# EasyEDA Pro project ProPrj_51单片机核心板_2025-02-26.epro

# Schematic 原理图
Board Name: 核心板; Create Date: 2025-02-26; Page Name: P1; Project Name: 51单片机核心板; Schematic Name: 原理图; Update Date: 2025-02-26; Company: 嘉立创EDA; Page Size: A4; Version: V1.0
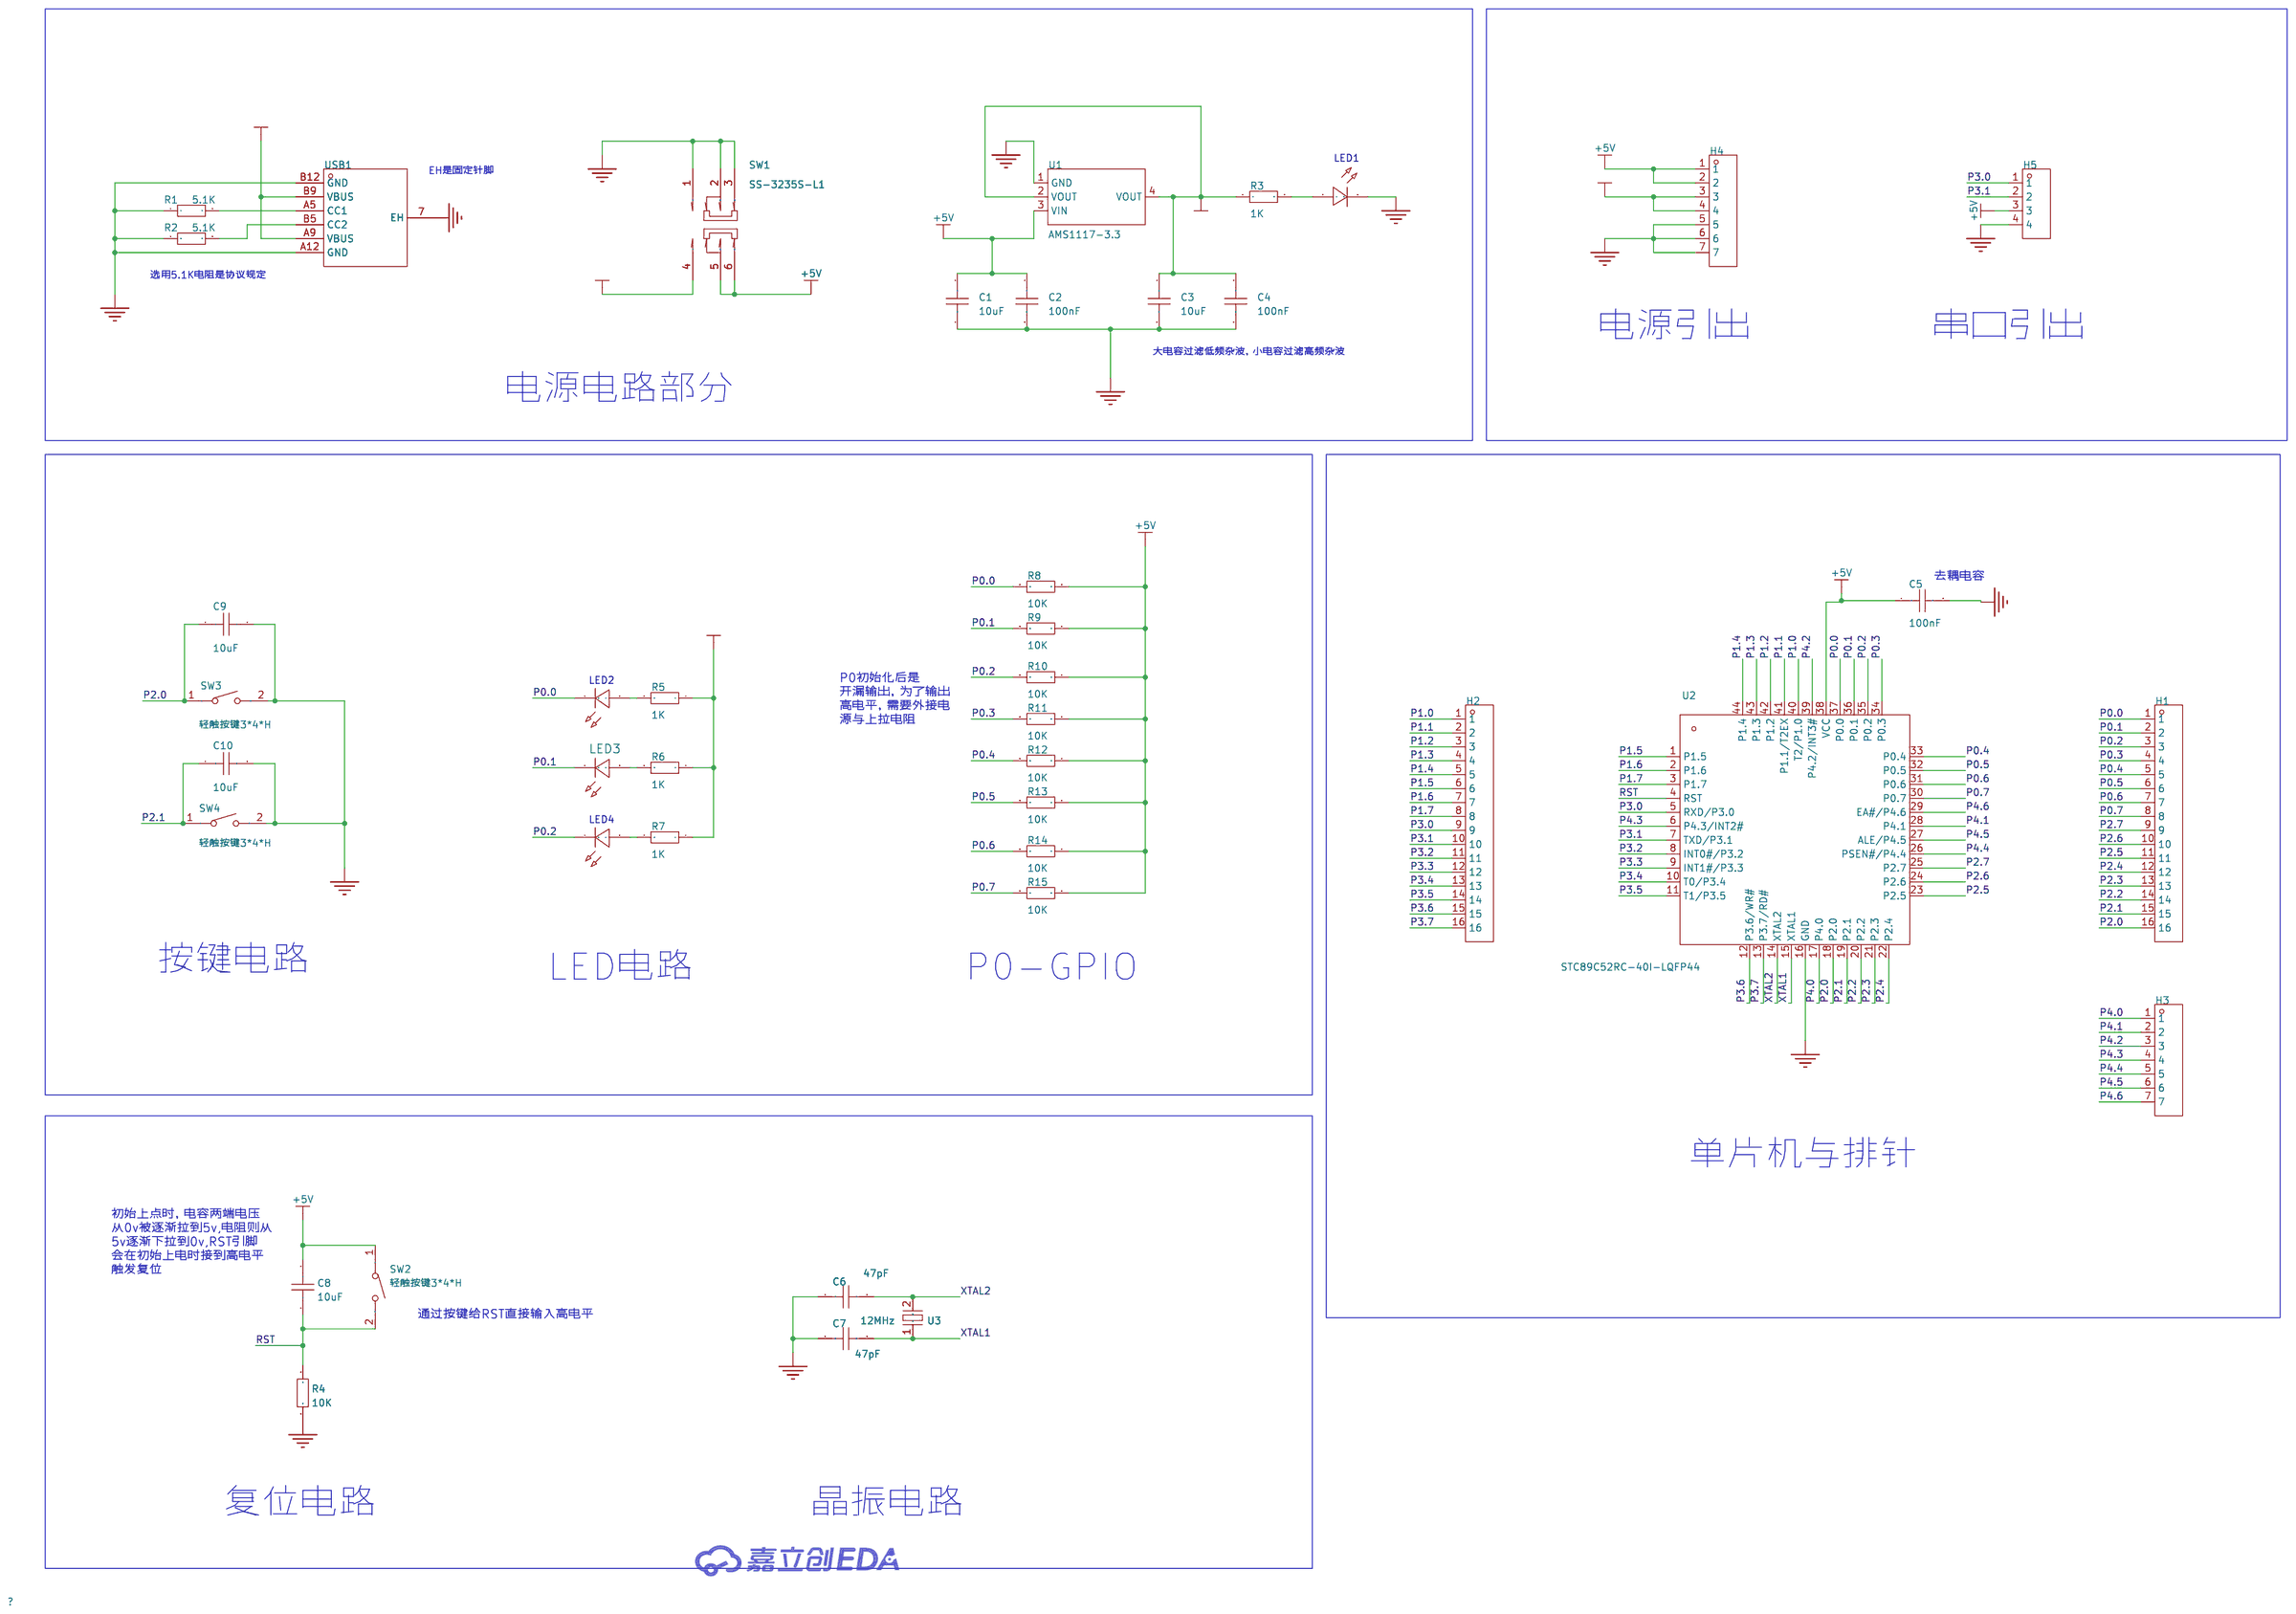
[diagram p0: schematic sheet]

## Parts
C1  10uF  [C0805]
C2  100nF  [C0805]
C3  10uF  [C0805]
C4  100nF  [C0805]
C5  100nF  [C0805]
C6  47pF  [C0805]
C7  47pF  [C0805]
C8  10uF  [C0805]
C9  10uF  [C0805]
C10  10uF  [C0805]
H1  -  [HDR-TH_16P-P2.54-V-M]
H2  -  [HDR-TH_16P-P2.54-V-M]
H3  -  [HDR-TH_7P-P2.54-V-M]
H4  -  [HDR-TH_7P-P2.54-V-M]
H5  -  [HDR-TH_4P-P2.54-V-M]
LED1  -  [LED_0805]
LED2  -  [LED_0805]
LED3  -  [LED_0805]
LED4  -  [LED_0805]
R1  5.1K  [R0805]
R2  5.1K  [R0805]
R3  1K  [R0805]
R4  10K  [R0805]
R5  1K  [R0805]
R6  1K  [R0805]
R7  1K  [R0805]
R8  10K  [R0805]
R9  10K  [R0805]
R10  10K  [R0805]
R11  10K  [R0805]
R12  10K  [R0805]
R13  10K  [R0805]
R14  10K  [R0805]
R15  10K  [R0805]
SW1  SS-3235S-L1  [SW-SMD_SS-3235S-LX]
SW2  轻触按键3*4*H  [SW-SMD_L4.0-W2.9-LS5.0]
SW3  轻触按键3*4*H  [SW-SMD_L4.0-W2.9-LS5.0]
SW4  轻触按键3*4*H  [SW-SMD_L4.0-W2.9-LS5.0]
U1  AMS1117-3.3  [SOT-223-3_L6.5-W3.4-P2.30-LS7.0-BR]
U2  STC89C52RC-40I-LQFP44  [LQFP-44_L10.0-W10.0-P0.80-LS12.0-BL]
U3  12MHz  [CRYSTAL-SMD_L11.4-W4.7-LS12.7]
USB1  TYPE-C-6P-DIP2X2  [TYPE-C-SMD_TYPE-C-6P]

## Library data of the parts
C1-C10 = CAP_0805: Supplier Footprint: 0805
H1 H2 = HDR-M_2.54_1x16P: 间距:2.54mm;总PIN位数:16;排数:1;插针结构:1x16P;行距:-;安装类型:直插;圆针/方针:方针;额定电流:3A;额定电压:-;配合针长度:6mm;塑高:2.5mm;端接针长度:3mm;触头材质:-;工作温度范围:-40℃~+105℃;颜色:黑色;; Supplier Part: C2894939; Supplier Footprint: 插件
H3 H4 = HDR-M_2.54_1x7P: Supplier Part: C492406; Supplier Footprint: 插件
H5 = HDR-M_2.54_1x4P: Supplier Part: C492403; Supplier Footprint: 插件
LED1 LED2 = LED_0805-G: Supplier Footprint: 0805
LED3 = LED_0805-R: Supplier Footprint: 0805
LED4 = LED_0805-B: Supplier Footprint: 0805
R1-R15 = Res_0805: Supplier Footprint: 0805
SW1 = SS-3235S-L1: 电路结构:双刀双掷;安装方式:卧贴;开关颜色:黑色;额定电流(DC):50mA;额定电压(DC):12V;额定电流(AC):50mA;额定电压(AC):12V;机械寿命:1万次;; LCSC Part Name: 柄长2mm 卧贴双档 滑动开关; Supplier Part: C500055; Manufacturer: XKB Connectivity(中国星坤); Supplier Footprint: SMD; JLCPCB Part Class: 扩展库; Datasheet: https://atta.szlcsc.com/upload/public/pdf/source/20211011/39D516E750C13BE9339464E723D9F132.pdf; Supplier: LCSC; Circuit: 双刀双掷; Actuator Style: 矩形柱状; Pin Style: 鸥翼型; Switch Length: 9.1mm; Switch Width: 3.55mm; Switch Height: 3.2mm; Mounting Style: 卧贴; Actuator Color: 黑色; Current Rating (DC): 50mA; Voltage Rating (DC): 12V; Current Rating (AC): 50mA; Voltage Rating (AC): 12V; Mechanical Life: 1万次; Operating Temperature: -40℃~+85℃
SW2-SW4 = 轻触按键3*4*H: Supplier Part: C9900017573; Supplier Footprint: 轻触按键3*4*2.5; JLCPCB Part Class: 扩展库; Supplier: LCSC
U1 = AMS1117-3.3_C6186: 输出类型:固定;工作电压:-;输出电压:3.3V;输出电流:1A;电源纹波抑制比(PSRR):72dB@(120Hz);输出极性:正极;; LCSC Part Name: 输出3.3V 1A; Supplier Part: C6186; Manufacturer: AMS; Supplier Footprint: SOT-223; JLCPCB Part Class: 基础库; Datasheet: https://atta.szlcsc.com/upload/public/pdf/source/20180727/C6186_7A095716F0823C02F1997A905E26C086.pdf; Supplier: LCSC; Output Type: 固定; Output Voltage: 3.3V; Output Current: 1A; Power Supply Rejection Ratio (PSRR): 72dB@(120Hz); Voltage Dropout: 1.3V@(800mA); Features: 过流保护(OCP)；热保护(TSD); Output Configuration: 正极; Number of Outputs: 1
U2 = STC89C52RC-40I-LQFP44: CPU内核:51系列;应用领域:-;; Supplier Part: C8707; Manufacturer: STC; Supplier Footprint: LQFP-44(10x10); JLCPCB Part Class: 扩展库; Datasheet: https://atta.szlcsc.com/upload/public/pdf/source/20241226/242305099CBBF4767F79975207B2F263.pdf; Supplier: LCSC; CPU Core: 51系列; Program Storage Size: 8KB; Program Memory Type: FLASH; Number of I/O: 39; Low Voltage Detection Threshold: 3.3V~5.5V
U3 = ABLS-12.000MHZ-B4H-T: 频率:12MHz;常温频差:±30ppm;外接负载电容:18pF;频率稳定度(全温):±35ppm;; LCSC Part Name: 12MHz ±30ppm 18pF; Supplier Part: C1986452; Manufacturer: ABRACON; Supplier Footprint: HC-49S-SMD; JLCPCB Part Class: 扩展库; Datasheet: https://atta.szlcsc.com/upload/public/pdf/source/20210612/96A8D0E14BE5C26ADD56CBF11909D043.pdf; Supplier: LCSC; Normal temperature Frequency Tolerance: ±30ppm; External load capacitor: 18pF; Frequency Stability(Full temperature range): ±35ppm; Equivalent Series Resistance (ESR): 50Ω; Operating Temperature: -20℃~+70℃
USB1 = TYPE-C-6P-DIP2X2: Supplier Part: C9900017627; Supplier Footprint: TYPE-C-6P; JLCPCB Part Class: 扩展库; Supplier: LCSC

## Nets
+3.3V: C3.1 C4.1 H4.3 H4.4 R3.1 R5.1 R6.1 R7.1 U1.2(VOUT) U1.4(VOUT)
+5V: C1.1 C2.1 C5.1 C8.2 H4.1 H4.2 H5.3 R8.1 R9.1 R10.1 R11.1 R12.1 R13.1 R14.1 R15.1 SW1.5 SW1.6 SW2.1 U1.3(VIN) U2.38(VCC)
GND: C1.2 C2.2 C3.2 C4.2 C5.2 C6.1 C7.1 C9.2 C10.2 H4.5 H4.6 H4.7 H5.4 LED1.1(C) R1.1 R2.1 R4.1 SW1.1 SW1.2 SW1.3 SW3.2 SW4.2 U1.1(GND) U2.16(GND) USB1.7(EH) USB1.A12(GND) USB1.B12(GND)
VCC+5V: SW1.4 USB1.A9(VBUS) USB1.B9(VBUS)
P0.0: H1.1 LED2.1(C) R8.2 U2.37(P0.0)
P0.1: H1.2 LED3.1(C) R9.2 U2.36(P0.1)
P0.2: H1.3 LED4.1(C) R10.2 U2.35(P0.2)
P0.3: H1.4 R11.2 U2.34(P0.3)
P0.4: H1.5 R12.2 U2.33(P0.4)
P0.5: H1.6 R13.2 U2.32(P0.5)
P0.6: H1.7 R14.2 U2.31(P0.6)
P0.7: H1.8 R15.2 U2.30(P0.7)
P1.0: H2.1 U2.40(T2/P1.0)
P1.1: H2.2 U2.41(P1.1/T2EX)
P1.2: H2.3 U2.42(P1.2)
P1.3: H2.4 U2.43(P1.3)
P1.4: H2.5 U2.44(P1.4)
P1.5: H2.6 U2.1(P1.5)
P1.6: H2.7 U2.2(P1.6)
P1.7: H2.8 U2.3(P1.7)
P2.0: C9.1 H1.16 SW3.1 U2.18(P2.0)
P2.1: C10.1 H1.15 SW4.1 U2.19(P2.1)
P2.2: H1.14 U2.20(P2.2)
P2.3: H1.13 U2.21(P2.3)
P2.4: H1.12 U2.22(P2.4)
P2.5: H1.11 U2.23(P2.5)
P2.6: H1.10 U2.24(P2.6)
P2.7: H1.9 U2.25(P2.7)
P3.0: H2.9 H5.1 U2.5(RXD/P3.0)
P3.1: H2.10 H5.2 U2.7(TXD/P3.1)
P3.2: H2.11 U2.8(INT0#/P3.2)
P3.3: H2.12 U2.9(INT1#/P3.3)
P3.4: H2.13 U2.10(T0/P3.4)
P3.5: H2.14 U2.11(T1/P3.5)
P3.6: H2.15 U2.12(P3.6/WR#)
P3.7: H2.16 U2.13(P3.7/RD#)
P4.0: H3.1 U2.17(P4.0)
P4.1: H3.2 U2.28(P4.1)
P4.2: H3.3 U2.39(P4.2/INT3#)
P4.3: H3.4 U2.6(P4.3/INT2#)
P4.4: H3.5 U2.26(PSEN#/P4.4)
P4.5: H3.6 U2.27(ALE/P4.5)
P4.6: H3.7 U2.29(EA#/P4.6)
RST: C8.1 R4.2 SW2.2 U2.4(RST)
XTAL1: C7.2 U2.15(XTAL1) U3.1
XTAL2: C6.2 U2.14(XTAL2) U3.2(GND)
Net-(LED1-2): LED1.2(A) R3.2
Net-(LED2-2): LED2.2(A) R5.2
Net-(LED3-2): LED3.2(A) R6.2
Net-(LED4-2): LED4.2(A) R7.2
Net-(R1-2): R1.2 USB1.A5(CC1)
Net-(R2-2): R2.2 USB1.B5(CC2)

## Notes on the sheet
- EH是固定针脚
- 选用5.1K电阻是协议规定
- 电源引出
- 串口引出
- 大电容过滤低频杂波，小电容过滤高频杂波
- 电源电路部分
- 去耦电容
- P0初始化后是
  开漏输出，为了输出
  高电平，需要外接电
  源与上拉电阻
- 按键电路
- LED电路
- P0-GPIO
- 单片机与排针
- 初始上点时，电容两端电压
  从0v被逐渐拉到5v,电阻则从
  5v逐渐下拉到0v,RST引脚
  会在初始上电时接到高电平
  触发复位
- 通过按键给RST直接输入高电平
- 复位电路
- 晶振电路
